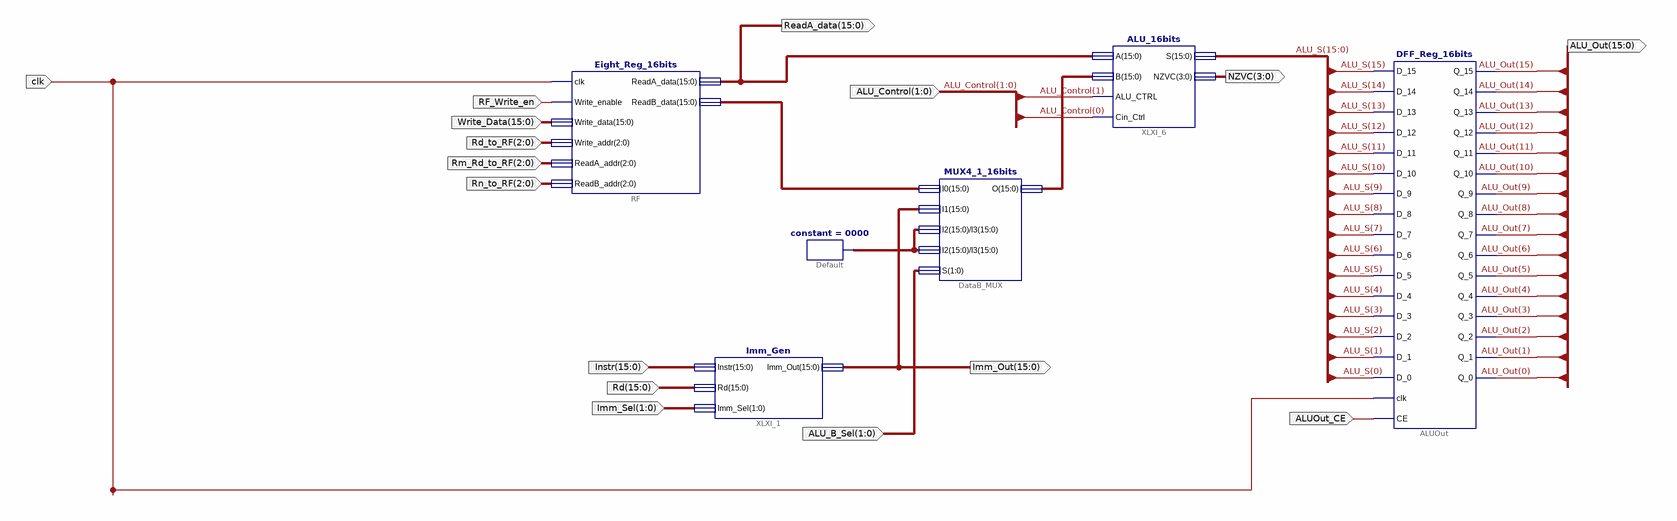
[diagram p0: schematic sheet 1]
// Xilinx ISE schematic A_16bits_RF_plus_ALU.sch (virtex6) as structural Verilog: 6 symbols, 16 ports
module A_16bits_RF_plus_ALU (
  input  [15:0] Write_Data,
  input  [1:0] ALU_B_Sel,
  input  clk,
  input  ALUOut_CE,
  input  RF_Write_en,
  input  [2:0] Rd_to_RF,
  input  [2:0] Rm_Rd_to_RF,
  input  [2:0] Rn_to_RF,
  input  [15:0] Instr,
  input  [1:0] Imm_Sel,
  input  [15:0] Rd,
  input  [1:0] ALU_Control,
  output [15:0] ALU_Out,
  output [15:0] Imm_Out,
  output [3:0] NZVC,
  output [15:0] ReadA_data
);

  wire [15:0] ALU_S, B, XLXN_79, XLXN_94;

  Eight_Reg_16bits RF (
    .clk(clk), .ReadA_addr(Rm_Rd_to_RF), .ReadA_data(ReadA_data), .ReadB_addr(Rn_to_RF),
    .ReadB_data(XLXN_94), .Write_addr(Rd_to_RF), .Write_data(Write_Data), .Write_enable(RF_Write_en));
  DFF_Reg_16bits ALUOut (
    .CE(ALUOut_CE), .clk(clk), .D_0(ALU_S[0]), .D_1(ALU_S[1]), .D_10(ALU_S[10]), .D_11(ALU_S[11]),
    .D_12(ALU_S[12]), .D_13(ALU_S[13]), .D_14(ALU_S[14]), .D_15(ALU_S[15]), .D_2(ALU_S[2]), .D_3(ALU_S[3]),
    .D_4(ALU_S[4]), .D_5(ALU_S[5]), .D_6(ALU_S[6]), .D_7(ALU_S[7]), .D_8(ALU_S[8]), .D_9(ALU_S[9]),
    .Q_0(ALU_Out[0]), .Q_1(ALU_Out[1]), .Q_10(ALU_Out[10]), .Q_11(ALU_Out[11]), .Q_12(ALU_Out[12]),
    .Q_13(ALU_Out[13]), .Q_14(ALU_Out[14]), .Q_15(ALU_Out[15]), .Q_2(ALU_Out[2]), .Q_3(ALU_Out[3]),
    .Q_4(ALU_Out[4]), .Q_5(ALU_Out[5]), .Q_6(ALU_Out[6]), .Q_7(ALU_Out[7]), .Q_8(ALU_Out[8]), .Q_9(ALU_Out[9]));
  constant #(.CValue("0000")) Default (.O(XLXN_79));
  MUX4_1_16bits DataB_MUX (.I0(XLXN_94), .I1(Imm_Out), .I2(XLXN_79), .I3(XLXN_79), .O(B), .S(ALU_B_Sel));
  Imm_Gen XLXI_1 (.Imm_Out(Imm_Out), .Imm_Sel(Imm_Sel), .Instr(Instr), .Rd(Rd));
  ALU_16bits XLXI_6 (
    .A(ReadA_data), .B(B), .ALU_CTRL(ALU_Control[1]), .Cin_Ctrl(ALU_Control[0]), .S(ALU_S), .NZVC(NZVC));
endmodule
